# EAGLE design moonclock (EAGLE 9.6.2)
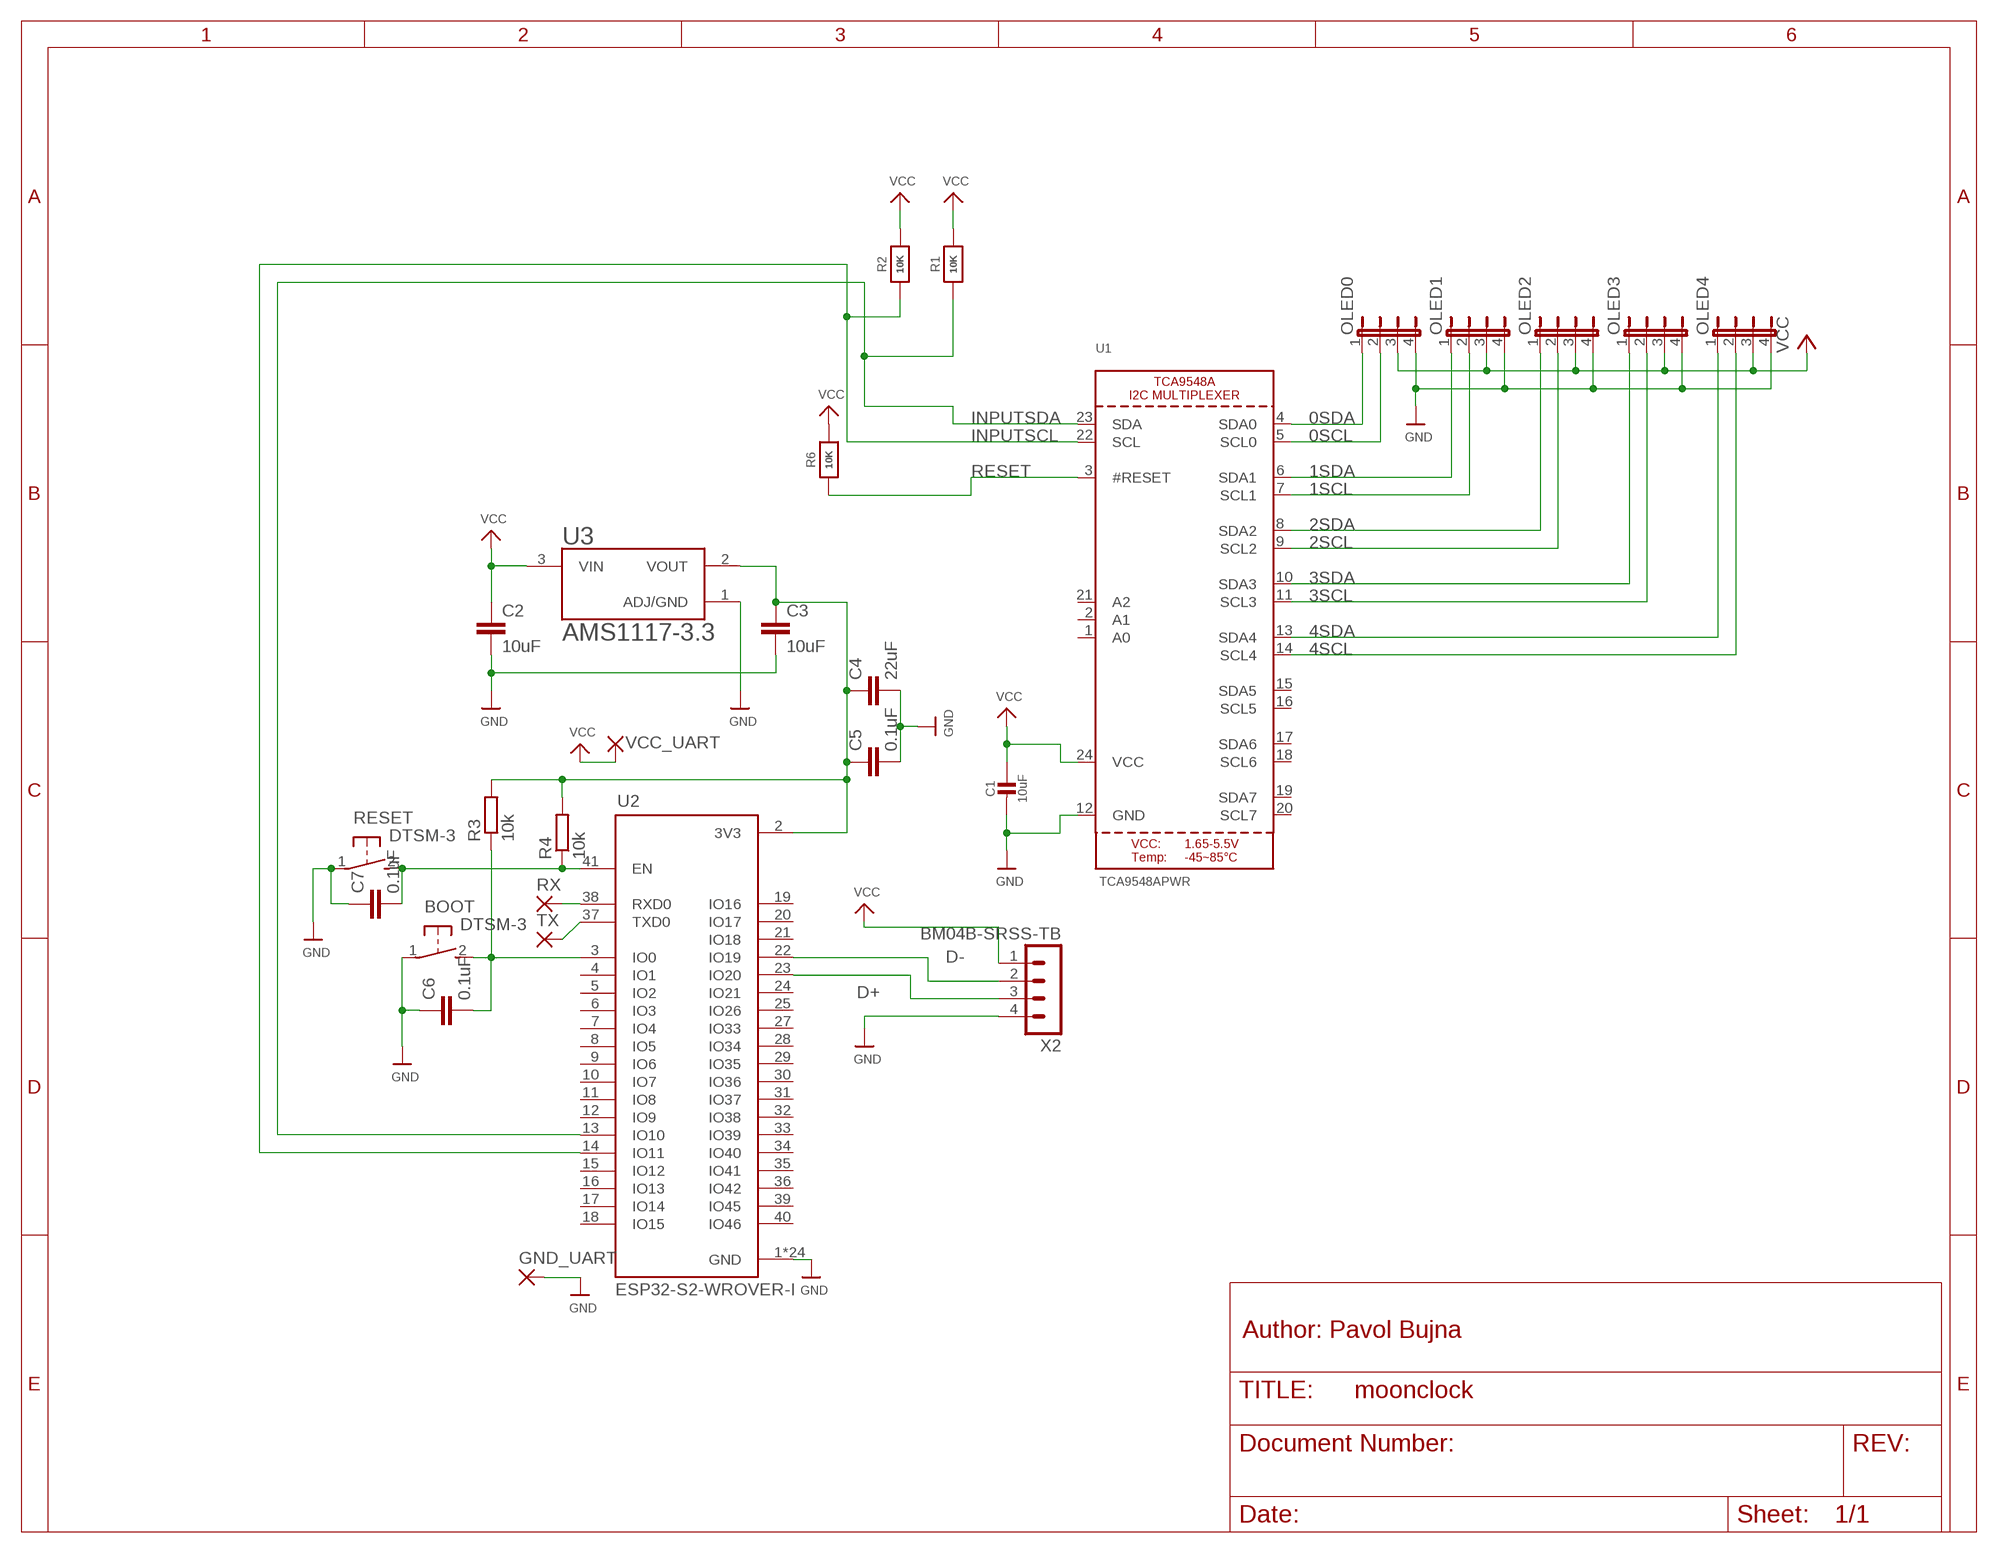
[diagram p0: schematic, sheet 1]

## Parts
BOOT  DTSM-3  [DTSM-3]
C1  10uF  CAP_CERAMIC0805-NOOUTLINE  [0805-NO]
C2  10uF  C-EUC0805  [C0805]
C3  10uF  C-EUC0805  [C0805]
C4  22uF  C-EUC0805  [C0805]
C5  0.1uF  C-EUC0805  [C0805]
C6  0.1uF  C-EUC0805  [C0805]
C7  0.1uF  C-EUC0805  [C0805]
GND_UART  SMD2  [SMD1,27-2,54]
OLED0  JP4E  [JP4]
OLED1  JP4E  [JP4]
OLED2  JP4E  [JP4]
OLED3  JP4E  [JP4]
OLED4  JP4E  [JP4]
R1  10K  RESISTOR0805_NOOUTLINE  [0805-NO]
R2  10K  RESISTOR0805_NOOUTLINE  [0805-NO]
R3  10k  R-EU_R0805  [R0805]
R4  10k  R-EU_R0805  [R0805]
R6  10K  RESISTOR_0805MP  [_0805MP]
RESET  DTSM-3  [DTSM-3]
RX  SMD2  [SMD1,27-2,54]
TX  SMD2  [SMD1,27-2,54]
U1  TCA9548APWR  TCA9548A  [TSSOP24]
U2  ESP32-S2-WROVER-I  [ESP32-S2-WROVER-I]
U3  AMS1117-3.3  [SOT229P700X180-4N]
VCC_UART  SMD2  [SMD1,27-2,54]
X2  BM04B-SRSS-TB  [BM04B-SRSS-TB]

## Nets
0SCL: OLED0.2 U1.5(SCL0)
0SDA: OLED0.1 U1.4(SDA0)
1SCL: OLED1.2 U1.7(SCL1)
1SDA: OLED1.1 U1.6(SDA1)
2SCL: OLED2.2 U1.9(SCL2)
2SDA: OLED2.1 U1.8(SDA2)
3SCL: OLED3.2 U1.11(SCL3)
3SDA: OLED3.1 U1.10(SDA3)
4SCL: OLED4.2 U1.14(SCL4)
4SDA: OLED4.1 U1.13(SDA4)
D+: U2.23(IO20) X2.3
D-: U2.22(IO19) X2.2
GND: BOOT.1 C1.2 C2.2 C3.2 C4.2 C5.2 C6.1 C7.1 GND_UART.1(P) OLED0.4 OLED1.4 OLED2.4 OLED3.4 OLED4.4 RESET.1 U1.12(GND) U2.1(GND) U2.26(GND) U2.42(GND) U2.43.1(GND) U2.43.2(GND) U2.43.3(GND) U2.43.4(GND) U2.43.5(GND) U2.43.6(GND) U2.43.7(GND) U2.43.8(GND) U2.43.9(GND) U2.43.10(GND) U2.43.11(GND) U2.43.12(GND) U2.43.13(GND) U2.43.14(GND) U2.43.15(GND) U2.43.16(GND) U2.43.17(GND) U2.43.18(GND) U2.43.19(GND) U2.43.20(GND) U2.43.21(GND) U3.1(ADJ/GND) X2.4
INPUTSCL: R2.1 U1.22(SCL) U2.14(IO11)
INPUTSDA: R1.1 U1.23(SDA) U2.13(IO10)
N$5: TX.1(P) U2.37(TXD0)
N$6: RX.1(P) U2.38(RXD0)
N$7: C3.1 C4.1 C5.1 R3.2 R4.2 U2.2(3V3) U3.2(VOUT)
N$8: BOOT.2 C6.2 R3.1 U2.3(IO0)
N$10: C7.2 R4.1 RESET.2 U2.41(EN)
RESET: R6.1 U1.3(#RESET)
VCC: C1.1 C2.1 OLED0.3 OLED1.3 OLED2.3 OLED3.3 OLED4.3 R1.2 R2.2 R6.2 U1.24(VCC) U3.3(VIN) VCC_UART.1(P) X2.1
Unconnected: U1.1(A0) U1.2(A1) U1.15(SDA5) U1.16(SCL5) U1.17(SDA6) U1.18(SCL6) U1.19(SDA7) U1.20(SCL7) U1.21(A2) U2.4(IO1) U2.5(IO2) U2.6(IO3) U2.7(IO4) U2.8(IO5) U2.9(IO6) U2.10(IO7) U2.11(IO8) U2.12(IO9) U2.15(IO12) U2.16(IO13) U2.17(IO14) U2.18(IO15) U2.19(IO16) U2.20(IO17) U2.21(IO18) U2.24(IO21) U2.25(IO26) U2.27(IO33) U2.28(IO34) U2.29(IO35) U2.30(IO36) U2.31(IO37) U2.32(IO38) U2.33(IO39) U2.34(IO40) U2.35(IO41) U2.36(IO42) U2.39(IO45) U2.40(IO46)

## Notes on the sheet
- Author: Pavol Bujna

## Library data of the parts
BOOT RESET = switch-tact:DTSM-3
C1 = microbuilder:CAP_CERAMIC: Ceramic Capacitors For new designs, use the packages preceded by an '_' character since they are more reliable: The following footprints should be used on most boards: _0402 - Standard footprint for regular board layouts _0603 - Standard footprint for regular board layouts _0805 - Standard footprint for regular board layouts _1206 - Standard footprint for regular board layouts For extremely tight-pitch boards where space is at a premium, the following 'micro-pitch' footprints can be used (smaller pads, no silkscreen outline, etc.): _0402MP - Micro-pitch footprint for very dense/compact boards _0603MP - Micro-pitch footprint for very dense/compact boards _0805MP - Micro-pitch footprint for very dense/compact boards _1206MP - Micro-pitch footprint for very dense/compact boards
C2-C7 = rcl:C-EU: CAPACITOR, European symbol; SPICEPREFIX: C
GND_UART RX TX VCC_UART = wirepad:SMD2: SMD PAD
OLED0 OLED1-OLED4 = jumper:JP4E: JUMPER
R1 R2 R6 = microbuilder:RESISTOR: Resistors For new designs, use the packages preceded by an '_' character since they are more reliable: The following footprints should be used on most boards: _0402 - Standard footprint for regular board layouts _0603 - Standard footprint for regular board layouts _0805 - Standard footprint for regular board layouts _1206 - Standard footprint for regular board layouts For extremely tight-pitch boards where space is at a premium, the following 'micro-pitch' footprints can be used (smaller pads, no silkscreen outline, etc.): _0402MP - Micro-pitch footprint for very dense/compact boards _0603MP - Micro-pitch footprint for very dense/compact boards _0805MP - Micro-pitch footprint for very dense/compact boards _1206MP - Micro-pitch footprint for very dense/compact boards
R3 R4 = rcl:R-EU_: RESISTOR, European symbol; SPICEPREFIX: R
U1 = microbuilder:TCA9548A: TCA9548A I2C Multiplexer
U2 = ESP32-S2-WROVER-I:ESP32-S2-WROVER-I: ESP32-S2-WROVER-I Module with uFL - 4 MB flash and 2 MB PSRAM
U3 = AMS1117-3.3:AMS1117-3.3: Sot223/Pkg 1-Amp 3.3-Volt Low Drop Out Voltage Regulatator; AVAILABILITY: Unavailable; DESCRIPTION: Sot223/Pkg 1-Amp 3.3-Volt Low Drop Out Voltage Regulatator; MF: Advanced Monolithic Systems; MP: AMS1117-3.3; PACKAGE: SOT-89 ams; PRICE: None
X2 = con-JST SH:BM04B-SRSS: JST SH series header 1.00mm pitch disconnectable crimp style connectors, vertical (side entry type), 4 pins

## Board
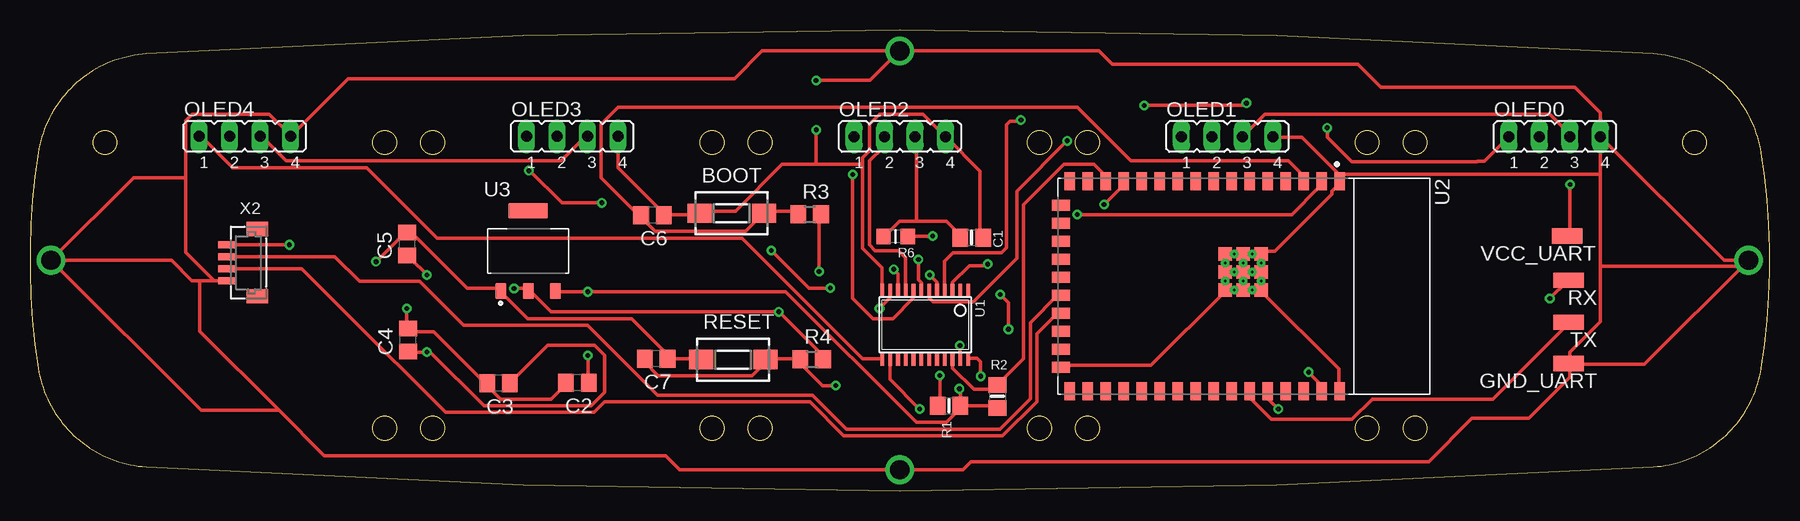
[diagram p1: board, top side]
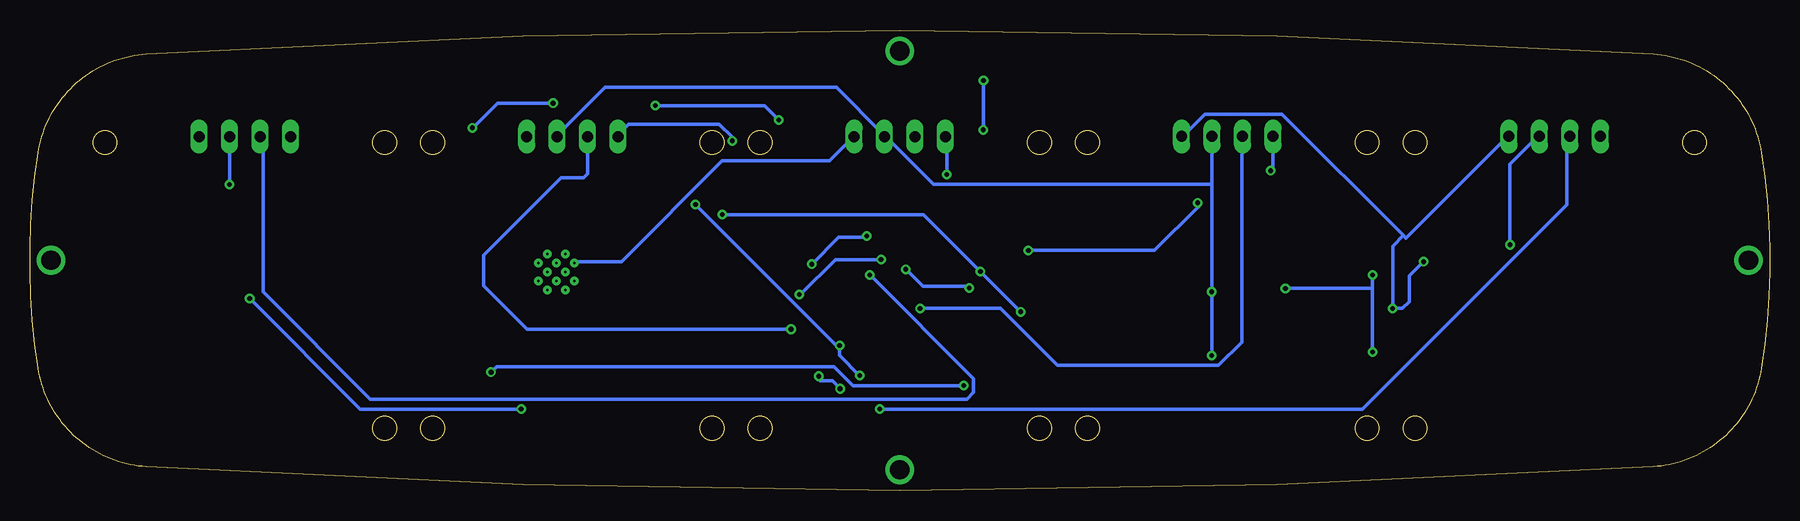
[diagram p2: board, bottom side, seen from below]

Size 145 x 38.4 mm. Coordinates in mm from the lower left corner, seen from the top.
Outline: 140.61,34.41 140.33,34.62 140.06,34.81 139.77,34.99 139.48,35.16 139.18,35.32 138.88,35.47 138.57,35.61 138.26,35.74 137.94,35.86 137.62,35.97 137.3,36.06 136.97,36.15 136.64,36.22 136.31,36.28 135.97,36.34 135.64,36.37 135.3,36.4 103.92,37.9 72.5,38.4 41.08,37.9 9.7,36.4 9.36,36.37 9.03,36.34 8.69,36.28 8.36,36.22 8.03,36.15 7.7,36.06 7.38,35.97 7.06,35.86 6.74,35.74 6.43,35.61 6.12,35.47 5.82,35.32 5.52,35.16 5.23,34.99 4.95,34.81 4.67,34.62 4.4,34.41 4.13,34.2 3.87,33.99 3.62,33.76 3.38,33.52 3.15,33.28 2.92,33.02 2.71,32.76 2.5,32.5 2.3,32.22 2.12,31.94 1.94,31.65 1.77,31.36 1.61,31.06 1.47,30.75 1.33,30.45 1.2,30.13 1.09,29.81 0.99,29.49 0.89,29.17 0.81,28.84 0.74,28.51 0.69,28.17 0.41,26.19 0.21,24.2 0.07,22.2 0,20.2 0,18.2 0.07,16.2 0.21,14.2 0.41,12.21 0.69,10.23 0.74,9.89 0.81,9.56 0.89,9.23 0.99,8.91 1.09,8.59 1.2,8.27 1.33,7.95 1.47,7.64 1.61,7.34 1.77,7.04 1.94,6.75 2.12,6.46 2.3,6.18 2.5,5.9 2.71,5.64 2.92,5.38 3.15,5.12 3.38,4.88 3.62,4.64 3.87,4.41 4.13,4.19 4.4,3.98 4.67,3.78 4.95,3.59 5.23,3.41 5.52,3.24 5.82,3.08 6.12,2.93 6.43,2.79 6.74,2.66 7.06,2.54 7.38,2.43 7.7,2.34 8.03,2.25 8.36,2.18 8.69,2.11 9.03,2.06 9.36,2.02 9.7,2 41.08,0.5 72.5,0 103.92,0.5 135.3,2 135.64,2.02 135.97,2.06 136.31,2.11 136.64,2.18 136.97,2.25 137.3,2.34 137.62,2.43 137.94,2.54 138.26,2.66 138.57,2.79 138.88,2.93 139.18,3.08 139.48,3.24 139.77,3.41 140.06,3.59 140.33,3.78 140.61,3.98 140.87,4.19 141.13,4.41 141.38,4.64 141.62,4.88 141.85,5.12 142.08,5.38 142.29,5.64 142.5,5.9 142.7,6.18 142.89,6.46 143.06,6.75 143.23,7.04 143.39,7.34 143.53,7.64 143.67,7.95 143.8,8.27 143.91,8.59 144.01,8.91 144.11,9.23 144.19,9.56 144.26,9.89 144.31,10.23 144.59,12.21 144.8,14.2 144.93,16.2 145,18.2 145,20.2 144.93,22.2 144.8,24.2 144.59,26.19 144.31,28.17 144.26,28.51 144.19,28.84 144.11,29.17 144.01,29.49 143.91,29.81 143.8,30.13 143.67,30.45 143.53,30.75 143.39,31.06 143.23,31.36 143.06,31.65 142.89,31.94 142.7,32.22 142.5,32.5 142.29,32.76 142.08,33.02 141.85,33.28 141.62,33.52 141.38,33.76 141.13,33.99 140.87,34.2 140.61,34.41
Outline: circle at 56.85,5.22 radius 1
Outline: circle at 6.25,29.02 radius 1
Outline: circle at 29.55,29.02 radius 1
Outline: circle at 115.45,29.02 radius 1
Outline: circle at 60.85,29.02 radius 1
Outline: circle at 111.45,29.02 radius 1
Outline: circle at 88.15,29.02 radius 1
Outline: circle at 84.15,29.02 radius 1
Outline: circle at 138.75,29.02 radius 1
Outline: circle at 60.85,5.22 radius 1
Outline: circle at 56.85,29.02 radius 1
Outline: circle at 84.15,5.22 radius 1
Outline: circle at 33.55,5.22 radius 1
Outline: circle at 33.55,29.02 radius 1
Outline: circle at 111.45,5.22 radius 1
Outline: circle at 88.15,5.22 radius 1
Outline: circle at 29.55,5.22 radius 1
Outline: circle at 115.45,5.22 radius 1
Copper layers (1*16): Top 0.035mm / dielectric 1.5mm / Bottom 0.035mm
Design rules "adafruit *": minimum track width 12mil, minimum drill 15.5mil, track to track 10mil, track to pad 10mil, pad to pad 10mil, via to via 10mil, smd to smd 8mil, copper to edge 10mil, drill to drill 8mil, minimum pad ring 10mil, minimum via ring 8mil, stop-mask expansion 2mil, vias tented up to drill 20mil, thermal gap 10mil

### Footprints (pad centres in the part's own frame; a part is rotated, then mirrored left to right if it is on the bottom)
DTSM-3 = smd 2 x 1.6: 1 -2.7,0; 2 2.7,0
0805-NO = smd 1.3 x 1.5: 1 -0.95,0; 2 0.95,0
C0805 = smd 1.3 x 1.5: 1 -0.95,0; 2 0.95,0
SMD1,27-2,54 = smd 1.27 x 2.54: 1 0,0
JP4 = drill 0.914 long: 1 -3.81,0; 2 -1.27,0; 3 1.27,0; 4 3.81,0
R0805 = smd 1.3 x 1.5: 1 -0.95,0; 2 0.95,0
_0805MP = smd 1.2 x 1.3: 1 -1.016,0; 2 1.016,0
TSSOP24 = smd 0.305 x 0.991: 1 -3.575,-2.918; 2 -2.925,-2.918; 3 -2.275,-2.918; 4 -1.625,-2.918; 5 -0.975,-2.918; 6 -0.325,-2.918; 7 0.325,-2.918; 8 0.975,-2.918; 9 1.625,-2.918; 10 2.275,-2.918; 11 2.925,-2.918; 12 3.575,-2.918; 13 3.575,2.918; 14 2.925,2.918; 15 2.275,2.918; 16 1.625,2.918; 17 0.975,2.918; 18 0.325,2.918; 19 -0.325,2.918; 20 -0.975,2.918; 21 -1.625,2.918; 22 -2.275,2.918; 23 -2.925,2.918; 24 -3.575,2.918
ESP32-S2-WROVER-I = smd 1.5 x 0.9: 1 -8.75,8; 2 -8.75,6.5; 3 -8.75,5; 4 -8.75,3.5; 5 -8.75,2; 6 -8.75,0.5; 7 -8.75,-1; 8 -8.75,-2.5; 9 -8.75,-4; 10 -8.75,-5.5; 11 -8.75,-7; 12 -8.75,-8.5; 13 -8.75,-10; 14 -8.75,-11.5; 15 -8.75,-13; 16 -8.75,-14.5; 27 8.75,-14.5; 28 8.75,-13; 29 8.75,-11.5; 30 8.75,-10; 31 8.75,-8.5; 32 8.75,-7; 33 8.75,-5.5; 34 8.75,-4; 35 8.75,-2.5; 36 8.75,-1; 37 8.75,0.5; 38 8.75,2; 39 8.75,3.5; 40 8.75,5; 41 8.75,6.5; 42 8.75,8 | smd 0.9 x 1.5: 17 -6.75,-15.25; 18 -5.25,-15.25; 19 -3.75,-15.25; 20 -2.25,-15.25; 21 -0.75,-15.25; 22 0.75,-15.25; 23 2.25,-15.25; 24 3.75,-15.25; 25 5.25,-15.25; 26 6.75,-15.25 | smd 1.1 x 1.1: 43.1 -1.19,-0.05; 43.2 -2.69,-0.05; 43.3 0.31,-0.05; 43.4 -2.69,-1.55; 43.5 -1.19,-1.55; 43.6 0.31,-1.55; 43.7 -2.69,1.45; 43.8 -1.19,1.45; 43.9 0.31,1.45 | drill 0.2 pad 0.4: 43.10 -1.19,0.7; 43.11 -2.69,0.7; 43.12 0.31,0.7; 43.13 -2.69,-0.8; 43.14 -1.19,-0.8; 43.15 0.31,-0.8; 43.16 -1.94,1.45; 43.17 -0.44,1.45; 43.18 -1.94,-0.05; 43.19 -0.44,-0.05; 43.20 -1.94,-1.55; 43.21 -0.44,-1.55
SOT229P700X180-4N = smd 0.93 x 1.31: 1 -2.29,-3.345; 2 0,-3.345; 3 2.29,-3.345 | smd 3.24 x 1.31: 4 0,3.345
BM04B-SRSS-TB = smd 0.6 x 1.55: 1 1.5,0; 2 0.5,0; 3 -0.5,0; 4 -1.5,0 | smd 1.2 x 1.8: M1 2.8,-2.525; M2 -2.8,-2.525

### Placement (x,y rotation side)
BOOT  58.5,23.13 0 top
C1  78.5,21.1 0 top
C2  45.63,9.02 180 top
C3  39.06,8.95 180 top
C4  31.52,12.56 90 top
C5  31.45,20.57 90 top
C6  51.89,22.97 180 top
C7  52.19,11 180 top
GND_UART  128.25,10.61 90 top
OLED0  127.1,29.52 0 top
OLED1  99.8,29.52 0 top
OLED2  72.5,29.52 0 top
OLED3  45.19,29.53 0 top
OLED4  17.9,29.53 0 top
R1  76.61,7.09 0 top
R2  80.65,7.86 270 top
R3  64.99,23.04 0 top
R4  65.16,10.96 0 top
R6  72.17,21.19 180 top
RESET  58.62,10.94 0 top
RX  128.25,17.55 90 top
TX  128.26,14.04 90 top
U1  74.62,13.84 180 top
U2  101.17,17.04 270 top
U3  41.52,19.99 0 top
VCC_UART  128.13,21.24 90 top
X2  16.45,19.01 90 top

### Tracks (layer width: path | path; a pad name or v marks a point on that pad's centre or on a via)
0SCL  (via drill 0.39)
  Top 0.305: U1.5 | U1.5 75.6,17.39 v75,17.99
  Bottom 0.305: v75,17.99 66.34,9.32 66.34,8.21 66.9,7.65 116.63,7.65 125.57,16.59 125.57,29.44 OLED0.2
0SDA  (via drill 0.39)
  Top 0.305: U1.4 76.25,19.12 76.96,19.82 80.99,19.82 81.42,20.25 81.42,30.51 81.71,30.8 82.54,30.8 82.6,30.86 v82.6,30.9 | v92.88,32.11 101.21,32.11 v101.4,32.3 | v108.13,30.24 108.13,29.46 110.19,27.4 120.59,27.4 120.66,27.47 121.24,27.47 OLED0.1
  Bottom 0.305: v82.6,30.9 83.78,32.08 92.85,32.08 v92.88,32.11 | v101.4,32.3 106.01,32.3 108.07,30.24 v108.13,30.24
1SCL  (via drill 0.39)
  Top 0.305: U1.7 | U1.7 74.3,17.33 74.06,17.57 v74.06,19.27 | v80.87,16.36 81.57,15.66 v81.57,13.46
  Bottom 0.305: v74.06,19.27 77.86,19.27 80.77,16.36 v80.87,16.36 | v81.57,13.46 103.56,13.46 107.2,17.1 107.2,19.61 100.72,26.09 98.86,26.09 98.53,26.42 OLED1.2
1SDA  (via drill 0.39)
  Top 0.305: U1.6 74.94,16.09 75.28,15.75 78.63,15.75 82.26,19.38 82.26,24.97 v86.46,29.16
  Bottom 0.305: v86.46,29.16 86.46,29.44 87.57,30.56 95.12,30.56 95.95,29.72 OLED1.1
2SCL
  Top 0.305: U1.9 73,16.87 72.99,16.87 72.99,19.41 72.39,20.01 70.46,20.01 69.97,20.5 69.97,27.49 71.09,28.6 71.09,29.44 OLED2.2
2SDA  (via drill 0.39)
  Top 0.305: v68.57,26.37 68.57,16.03 70.25,14.35 71.93,14.35 73.6,16.03 73.6,16.59 U1.8
  Bottom 0.305: v68.57,26.37 68.57,29.44 OLED2.1
3SCL  (via drill 0.39)
  Top 0.305: v70.81,15.19 71.7,16.08 71.7,16.41 71.7,16.42 U1.11
  Bottom 0.305: v70.81,15.19 64.1,15.19 59.35,10.44 45.94,10.44 43.99,12.4 43.99,29.44 OLED3.2
3SDA  (via drill 0.39)
  Top 0.305: U1.10 72.35,18.07 72,18.42 v72,18.45 | v66.72,16.89 64.93,16.89 v61.79,20.03 v61.78,20.03 | v47.67,23.99 44.35,23.99 41.66,26.68 v41.58,26.68
  Bottom 0.305: v72,18.45 70.58,17.03 66.86,17.03 v66.72,16.89 | v61.78,20.03 51.28,20.03 47.63,23.68 47.63,23.95 v47.67,23.99 | v41.58,26.68 41.38,26.87 OLED3.1
4SCL  (via drill 0.39)
  Top 0.305: v74.16,6.81 71.7,9.27 71.7,10.91 U1.14
  Bottom 0.305: v74.16,6.81 33.93,6.81 16.88,23.85 16.88,29.44 OLED4.2
4SDA
  Top 0.305: U1.13 71,10.97 71.02,11 69.41,11 59.35,21.06 33.93,21.06 28.06,26.93 16.88,26.93 14.37,29.44 OLED4.1
D+
  Top 0.305: U2.23 85.64,14.79 83.94,13.08 83.94,7.44 81.08,4.57 67.83,4.57 65,7.4 47.88,7.4 47.01,6.53 34.63,6.53 26.37,14.79 22.64,18.51 X2.3
D-
  Top 0.305: U2.22 85.64,16.29 83.38,14.02 83.38,7.67 80.84,5.13 68.06,5.13 65.23,7.96 52.3,7.96 46.47,13.8 36.14,13.8 32.49,17.44 27.49,17.44 25.42,19.51 X2.2
GND  (via drill 0.39, 1.6)
  Top 0.305: 130.88,29.44 130.88,26.37 | 130.88,26.37 130.88,18.69 | 130.88,18.69 130.88,14.07 128.34,11.53 128.34,10.53 | 130.88,29.44 OLED0.4 141.22,19.2 v143.26,19.2 | U2.43.5 99.87,18.27 100.15,18.27 U2.43.14 | U2.43.5 99.87,17.99 99.87,17.71 U2.43.21 99.59,17.43 99.59,16.87 U2.43.6 | U2.43.6 99.87,16.87 100.15,16.87 U2.43.15 | U2.26 86.18,10.44 93.44,10.44 99.59,16.59 U2.43.6 | U2.43.5 99.59,18.27 99.59,18.82 U2.43.20 99.59,19.1 99.59,19.66 U2.43.4 99.87,19.66 100.15,19.66 U2.43.13 100.43,19.66 100.98,19.66 U2.43.2 101.26,19.66 | 109.09,26.37 109.09,25.81 U2.1 | 109.09,26.37 106.01,29.44 103.78,29.44 OLED1.4 | U2.43.3 101.26,16.87 101.26,17.43 U2.43.19 101.26,17.71 101.26,17.99 U2.43.1 101.26,18.27 101.26,18.82 U2.43.18 101.26,19.1 101.26,19.66 | 101.26,19.66 101.82,19.66 U2.43.11 102.1,19.66 102.38,19.66 U2.43.7 | U2.43.7 102.66,19.66 102.66,19.1 U2.43.16 102.66,18.82 102.66,18.27 U2.43.8 | U2.43.8 102.38,18.27 102.1,18.27 U2.43.10 | U2.43.8 102.66,17.99 102.66,17.71 U2.43.17 102.66,17.43 102.66,16.87 U2.43.9 | U2.43.9 102.38,16.87 102.1,16.87 U2.43.12 | U2.42 109.09,8.49 109.09,10.16 102.66,16.59 U2.43.9 | U2.1 109.09,25.53 108.53,24.97 108.53,24.69 103.78,19.94 102.66,19.94 U2.43.7 | 109.09,26.37 130.88,26.37 | 109.09,26.37 U2.1 | 52.93,23.02 55.72,23.02 BOOT.1 56,23.29 58.79,23.29 62.71,27.21 65.53,27.21 | 52.93,23.02 49.02,26.93 49.02,29.44 OLED3.4 | 52.93,23.02 C6.1 | U1.12 71.04,16.77 71.04,18.59 69.41,20.22 69.41,27.21 | 69.41,27.21 69.41,27.77 69.97,28.32 69.97,30.56 70.81,31.4 74.44,31.4 76.12,29.72 OLED2.4 76.4,29.44 79.19,26.65 79.19,21.34 C1.2 | 69.41,27.21 65.53,27.21
  Top 0.305: RESET.1 55.72,11 53.21,11 C7.1 52.93,11 52.93,11.56 50.13,14.35 41.47,14.35 39.24,16.59 U3.1 38.96,16.87 36.44,16.87 31.69,21.62 C5.2 31.27,21.52 v28.85,19.09 | C2.2 44.55,8.77 43.43,7.65 39.24,7.65 38.12,8.77 C3.2 37.84,9.05 33.65,13.24 31.69,13.24 C4.2 31.41,13.52 v31.41,15.19 | 12.97,26.1 12.97,19.89 15.35,17.51 X2.4 14.16,17.51 | 12.97,26.1 12.97,30.84 13.53,31.4 19.96,31.4 21.63,29.72 OLED4.4 26.54,34.35 58.72,34.35 61.02,36.65 v72.5,36.65 | v1.75,19.2 11.8,19.2 13.49,17.51 14.16,17.51 | v72.5,36.65 70.04,34.19 v65.53,34.19 | v65.55,30.08 65.53,30.05 65.53,27.21 | 14.16,17.51 14.16,13.3 20.76,6.7 | 20.76,6.7 24.54,2.92 53,2.92 54.17,1.75 v72.5,1.75 77.77,1.75 78.44,2.42 116.59,2.42 120.21,6.04 124.93,6.04 128.34,9.45 128.34,10.53 | v72.5,36.65 89.12,36.65 90.24,35.53 110.68,35.53 112.59,33.62 128.78,33.62 130.88,31.52 130.88,29.44 | v1.75,19.2 8.65,26.1 12.97,26.1 | v1.75,19.2 14.25,6.7 20.76,6.7 | v143.26,19.2 142.75,18.69 130.88,18.69 | 128.34,10.53 GND_UART.1 | 128.34,10.53 134.58,10.53 v143.26,19.2
  Bottom 0.305: 30.52,21.28 31.41,20.39 v31.41,15.19 30.62,15.19 30.04,15.77 30.04,17.9 v28.85,19.09 | OLED4.4 21.91,29.44 30.3,21.06 30.52,21.28 | 30.52,21.28 40.63,31.4 47.06,31.4 48.74,29.72 OLED3.4 | U2.43.20 99.59,19.1 95.68,19.1 87.29,27.49 78.35,27.49 76.4,29.44 OLED2.4 | v65.53,34.19 65.53,30.23 65.62,30.14 v65.55,30.08
INPUTSCL
  Top 0.305: U1.22 76.9,10.22 78.67,8.45 80.28,8.45 R2.1 80.87,9.05 82.82,11 82.82,23.85 86.18,27.21 88.69,27.21 89.53,26.37 89.53,25.81 U2.14
INPUTSDA  (via drill 0.39)
  Top 0.305: v77.51,12.12 77.51,11 U1.23 | v75.84,9.6 75.84,7.37 R1.1 | v89.53,23.85 90.93,25.25 90.93,25.53 U2.13
  Bottom 0.305: 77.51,11.84 77.51,11.28 v75.84,9.6 | 77.51,11.84 v89.53,23.85 | 77.51,11.84 v77.51,12.12
N$5
  Top 0.305: U2.37 101.82,8.21 101.82,7.65 103.5,5.97 110.2,5.97 111.88,7.65 121.94,7.65 128.09,13.8 TX.1
N$6  (via drill 0.39)
  Top 0.305: v104.06,6.81 103.22,7.65 103.22,8.21 U2.38 | v126.69,16.03 128.09,17.43 RX.1
  Bottom 0.305: v104.06,6.81 117.47,6.81 v126.69,16.03
N$7  (via drill 0.39)
  Top 0.305: C4.1 31.69,11.56 v33.09,11.56 33.37,11.56 37.84,7.09 46.78,7.09 47.9,8.21 47.9,11.28 47.06,12.12 43.15,12.12 40.07,9.05 C3.1 | v33.09,17.99 31.69,19.38 C5.1 | R4.2 66.34,11 v62.43,14.91 43.43,14.91 41.75,16.59 U3.2 41.47,16.87 v40.35,16.87 | v65.78,18.27 65.78,23.02 R3.2 | v87.29,23.02 105.18,23.02 107.41,25.25 107.41,25.53 U2.2
  Bottom 0.305: v33.09,11.56 33.09,16.87 | 33.09,16.87 v33.09,17.99 | v62.43,14.91 v65.78,18.27 70.53,23.02 v87.29,23.02 | v40.35,16.87 33.09,16.87
N$8
  Top 0.305: R3.1 63.82,23.29 61.31,23.29 BOOT.2 61.03,23.02 59.63,21.62 52.09,21.62 50.97,22.74 C6.2 50.69,23.02 47.62,26.09 47.62,30.56 49.02,31.96 87.29,31.96 91.76,27.49 104.9,27.49 106.01,26.37 106.01,25.81 U2.3
N$10  (via drill 0.39)
  Top 0.305: C7.2 51.25,10.72 52.37,9.6 60.19,9.6 61.31,10.72 RESET.2 61.59,11 64.1,11 R4.1 64.1,10.72 66.06,8.77 v67.18,8.77 | v106.57,9.88 107.41,9.05 107.41,8.49 U2.41
  Bottom 0.305: v106.57,9.88 106.1,10.35 77.98,10.35 76.4,8.77 v67.18,8.77
RESET  (via drill 0.39)
  Top 0.305: U1.3 76.9,17.37 78.3,18.77 79.72,18.77 v79.83,18.88 | R6.1 73.21,21.22 v75.25,21.22
  Bottom 0.305: v79.83,18.88 77.59,21.12 75.35,21.12 v75.25,21.22
VCC  (via drill 0.39)
  Top 0.305: v128.37,25.53 128.37,21.34 VCC_UART.1 | 73.88,22.46 76.4,22.46 77.51,21.34 C1.1 | 73.88,22.46 72.49,22.46 71.37,21.34 R6.2 | 73.88,22.46 73.88,29.44 OLED2.3 | OLED0.3 128.37,29.72 126.69,31.4 102.94,31.4 101.26,29.72 OLED1.3 | 77.79,7.09 76.4,5.69 73.88,5.69 62.99,16.59 v46.5,16.59 43.99,16.59 U3.3 | 77.79,7.09 80.59,7.09 R2.2 | 77.79,7.09 R1.2 77.56,8.46 77.58,8.48 77.56,8.5 v77.47,8.5 | v46.5,11.28 46.5,9.05 C2.1 | OLED4.3 19.4,29.44 21.36,27.49 44.27,27.49 46.22,29.44 OLED3.3 | v79.25,9.55 79.25,10.76 78.96,11.05 78.33,11.05 U1.24 | v21.63,20.5 16.46,20.5 X2.1
  Bottom 0.305: v128.37,25.53 128.37,29.44 OLED0.3 | OLED1.3 100.98,29.72 97.08,33.63 77.79,33.63 73.88,29.72 OLED2.3 73.6,29.44 69.69,25.53 46.5,25.53 | 46.5,25.53 46.5,29.44 OLED3.3 | 46.5,25.53 v46.5,16.59 v46.5,11.28 | v21.63,20.5 21.63,27.21 19.4,29.44 OLED4.3 | v77.47,8.5 78.13,9.15 79.14,9.15 79.25,9.27 v79.25,9.55